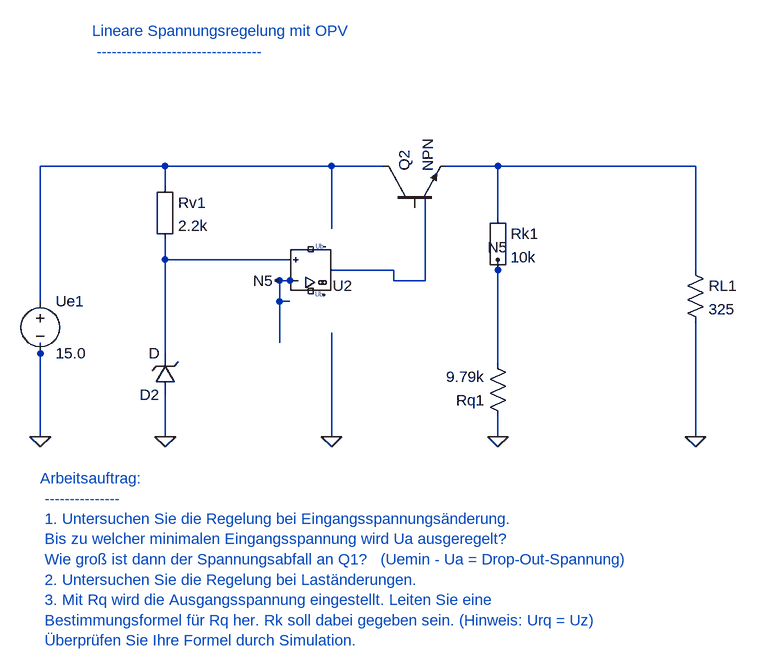
[diagram p0: schematic 5_7_6_Lineare_Spannungsregelung_mit_OPV.asc]
5_7_6_Lineare_Spannungsregelung_mit_OPV.asc, the LTspice schematic file:
Version 4
SHEET 1 880 680
WIRE 160 544 160 528
WIRE 736 320 736 304
WIRE 736 304 752 304
WIRE 784 256 816 256
WIRE 352 544 352 512
WIRE 544 432 528 432
WIRE 528 432 528 464
WIRE 528 464 544 464
WIRE 608 416 704 416
WIRE 704 416 704 432
WIRE 160 672 160 528
WIRE 1168 672 1168 496
WIRE 1168 416 1168 256
WIRE 1168 256 864 256
WIRE 352 368 352 400
WIRE 688 256 608 256
WIRE 352 608 352 672
WIRE 352 256 160 256
WIRE 160 256 160 464
WIRE 352 288 352 256
WIRE 704 432 752 432
WIRE 752 432 752 304
WIRE 608 256 352 256
WIRE 608 352 608 256
WIRE 608 672 608 512
WIRE 352 400 352 512
WIRE 544 400 352 400
WIRE 864 256 816 256
WIRE 864 336 864 256
WIRE 528 464 528 528
WIRE 864 528 864 416
WIRE 864 560 864 528
WIRE 864 640 864 672
WIRE 544 432 524 432
WIRE 864 416 864 400
FLAG 160 672 0
FLAG 352 672 0
FLAG 1168 672 0
FLAG 608 672 0
FLAG 864 672 0
FLAG 160 672 0
FLAG 352 672 0
FLAG 1168 672 0
FLAG 608 672 0
FLAG 864 672 0
FLAG 524 432 N5
FLAG 864 400 N5
SYMBOL voltage 160 448 R0
SYMATTR InstName Ue1
SYMATTR Value 15.0
SYMBOL Misc\EuropeanResistor 336 272 R0
SYMATTR InstName Rv1
SYMATTR Value 2.2k
SYMBOL res 1152 400 R0
SYMATTR InstName RL1
SYMATTR Value 325
SYMBOL npn 688 320 R270
SYMATTR InstName Q2
SYMATTR Value NPN
SYMBOL zener 368 608 R180
SYMATTR InstName D2
SYMATTR Value D
SYMBOL UniversalOpAmp2 576 416 M180
SYMATTR InstName U2
SYMATTR Value UniversalOpAmp2
SYMBOL Misc\EuropeanResistor 848 320 R0
SYMATTR InstName Rk1
SYMATTR Value 10k
SYMBOL res 880 656 R180
SYMATTR InstName Rq1
SYMATTR Value 9.79k
TEXT 240 48 Left 2 ;Lineare Spannungsregelung mit OPV \n ---------------------------------
TEXT 160 736 Left 2 ;Arbeitsauftrag: \n --------------- \n 1. Untersuchen Sie die Regelung bei Eingangsspannungsänderung. \n Bis zu welcher minimalen Eingangsspannung wird Ua ausgeregelt? \n Wie groß ist dann der Spannungsabfall an Q1?   (Uemin - Ua = Drop-Out-Spannung) \n 2. Untersuchen Sie die Regelung bei Laständerungen. \n 3. Mit Rq wird die Ausgangsspannung eingestellt. Leiten Sie eine \n Bestimmungsformel für Rq her. Rk soll dabei gegeben sein. (Hinweis: Urq = Uz) \n Überprüfen Sie Ihre Formel durch Simulation.

The netlist it stands for:
* 5_7_6_Lineare_Spannungsregelung_mit_OPV.asc
V§Ue1 N004 0 15.0
Rv1 N004 N003 2.2k
RL1 N002 0 325
Q2 N004 N001 N002 0 NPN
D2 0 N003 D
XU2 N003 N5 NC_01 NC_02 N001 level2 UniversalOpAmp2 Avol=1Meg GBW=10Meg Slew=10Meg Ilimit=25m Rail=0 Vos=0 En=0 Enk=0 In=0 Ink=0 Rin=500Meg  ; pins In+ In- V+ V- OUT
Rk1 N002 N5 10k
Rq1 0 N5 9.79k
.model D D
.lib standard.dio
.model NPN NPN
.model PNP PNP
.lib standard.bjt
* Lineare Spannungsregelung mit OPV
*  ---------------------------------
* Arbeitsauftrag:
*  ---------------
*  1. Untersuchen Sie die Regelung bei Eingangsspannungsänderung.
*  Bis zu welcher minimalen Eingangsspannung wird Ua ausgeregelt?
*  Wie groß ist dann der Spannungsabfall an Q1?   (Uemin - Ua = Drop-Out-Spannung)
*  2. Untersuchen Sie die Regelung bei Laständerungen.
*  3. Mit Rq wird die Ausgangsspannung eingestellt. Leiten Sie eine
*  Bestimmungsformel für Rq her. Rk soll dabei gegeben sein. (Hinweis: Urq = Uz)
*  Überprüfen Sie Ihre Formel durch Simulation.
.lib UniversalOpAmp2.lib
.backanno
.end